# Altium schematic sheet 7b - High Current Path Detection.SchDoc
size A4
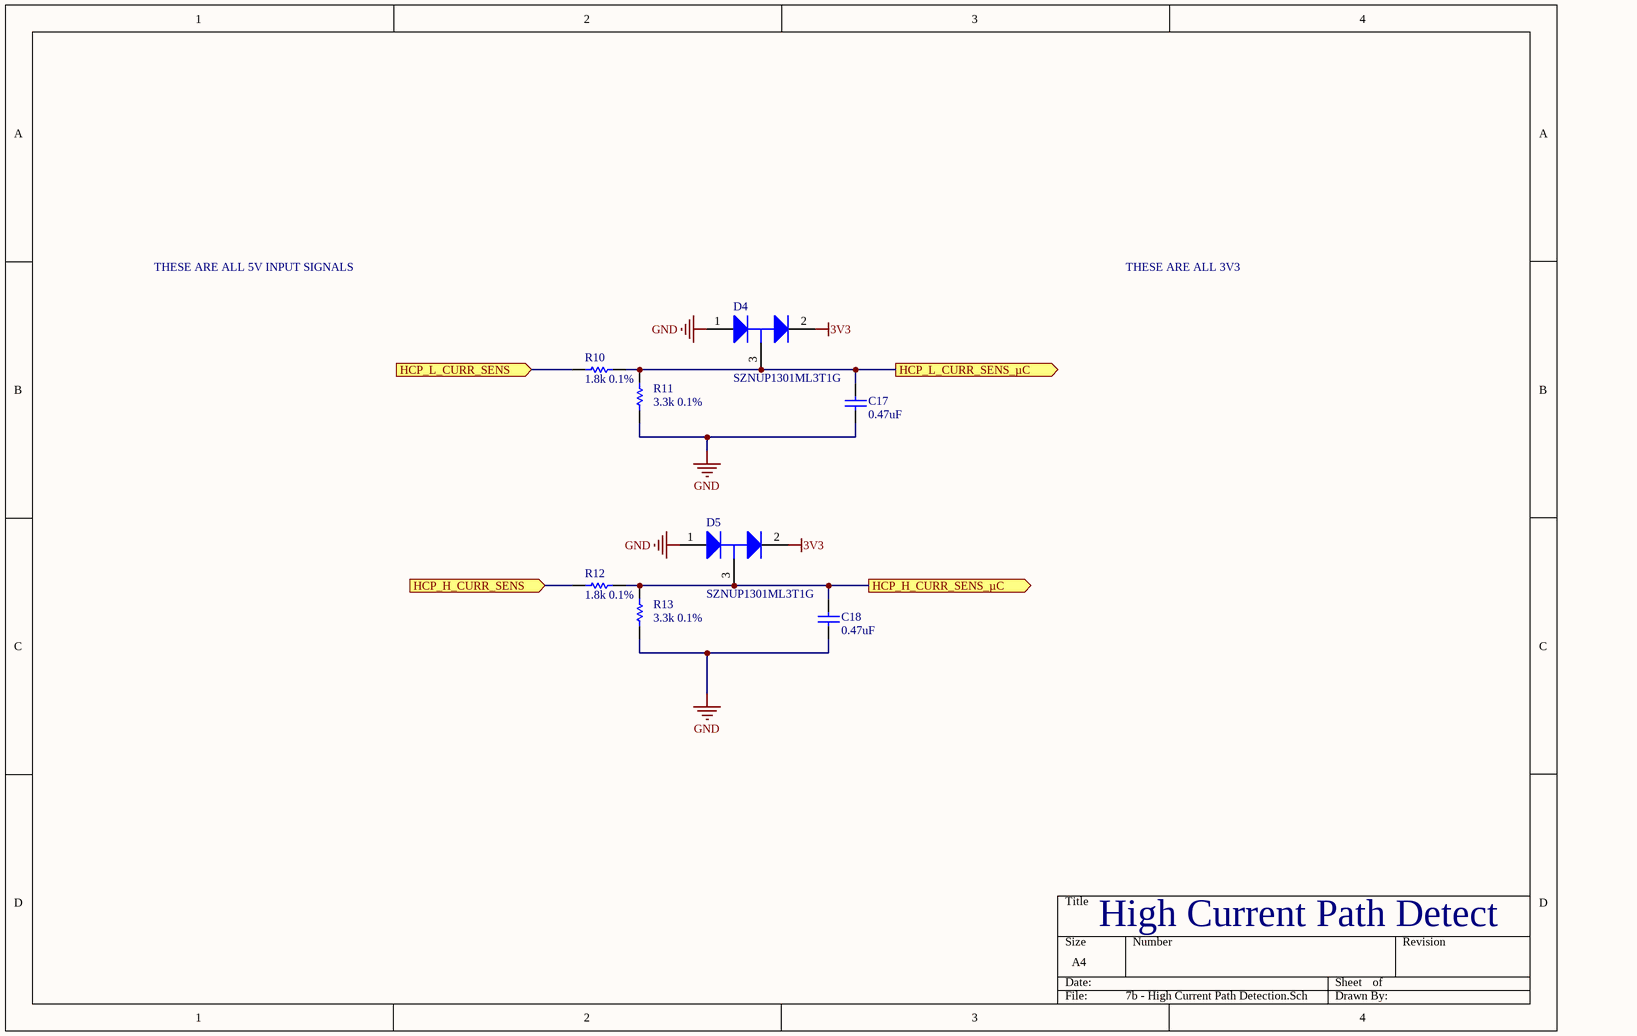
[diagram p0: 7b - High Current Path Detection.SchDoc]

## Parts
C17  value 0.47uF  [1608[0603]]  (hidden comment: Cap)
C18  value 0.47uF  [1608[0603]]  (hidden comment: Cap)
D4  SZNUP1301ML3T1G  [ONSC-SOT-23-3-318-08_V]
D5  SZNUP1301ML3T1G  [ONSC-SOT-23-3-318-08_V]
R10  value 1.8k 0.1%  [1608[0603]]  (hidden comment: Res1)
R11  value 3.3k 0.1%  [1608[0603]]  (hidden comment: Res1)
R12  value 1.8k 0.1%  [1608[0603]]  (hidden comment: Res1)
R13  value 3.3k 0.1%  [1608[0603]]  (hidden comment: Res1)

## Ports
HCP_H_CURR_SENS (in), HCP_H_CURR_SENS_µC (out), HCP_L_CURR_SENS (in), HCP_L_CURR_SENS_µC (out)

## Nets
3V3: D4.2(K) D5.2(K)
GND: C17.1 C18.1 D4.1(A) D5.1(A) R11.1 R13.1
HCP_H_CURR_SENS: R12.2 ; port HCP_H_CURR_SENS
HCP_H_CURR_SENS_µC: C18.2 D5.3(K/A) R12.1 R13.2 ; port HCP_H_CURR_SENS_µC
HCP_L_CURR_SENS: R10.2 ; port HCP_L_CURR_SENS
HCP_L_CURR_SENS_µC: C17.2 D4.3(K/A) R10.1 R11.2 ; port HCP_L_CURR_SENS_µC

## Notes on the sheet
- THESE ARE ALL 5V INPUT SIGNALS
- THESE ARE ALL 3V3
- High Current Path Detect

## Library data of the parts
C17 C18 = Cap: Capacitor; Published: 8-Jun-2000; LatestRevisionDate: 17-Jul-2002; LatestRevisionNote: Re-released for DXP Platform.; PackageReference: RAD-0.3; Publisher: Altium Limited; PackageDescription: Radial Cap, Thru-Hole; 2 Leads; 0.3 in Pin Spacing
D4 D5 = CMP-1063-00171-1: Low Capacitance Diode Array for ESD Protection in a Single Data Line, 3-Pin SOT-23, Pb-Free, Tape and Reel; Manufacturer: On Semiconductor; C Max (pF): 0.9; Direction: Bidirectional; V(BR) Min (V): 70; Number of Lines: 1; Mounting Technology: Surface Mount; PackageReference: SOT-23-3-318-08; DatasheetVersion: Rev. 6; PackageVersion: Rev. AP, 11/2009; RoHS: Pb-Free; ComponentLink1Description: Manufacturer URL; ComponentLink1URL: http://www.onsemi.com/; PackageDescription: 3-Pin Small Outline Transistor, Body 2.92 x 1.3 mm, Pitch 0.95 mm; PartNumber: SZNUP1301ML3T1G; Packing: Tape and Reel; ComponentLink3URL: http://www.onsemi.cn/pub_link/Collateral/318-08.PDF; ComponentLink3Description: Package Specification; VRWM Max (V): 70; ComponentLink2Description: Datasheet; ComponentLink2URL: http://www.onsemi.cn/pub_link/Collateral/NUP1301ML3T1-D.PDF
R10-R13 = Res1: Resistor; Published: 8-Jun-2000; LatestRevisionDate: 17-Jul-2002; LatestRevisionNote: Re-released for DXP Platform.; PackageReference: AXIAL-0.3; Publisher: Altium Limited; PackageDescription: Axial Device, Thru-Hole; 2 Leads; 0.3 in Pin Spacing